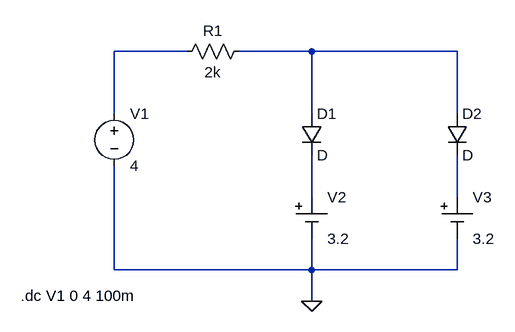
[diagram p0: schematic problem_354.asc]
problem_354.asc, the LTspice schematic file:
Version 4
SHEET 1 880 680
WIRE 160 32 48 32
WIRE 352 32 240 32
WIRE 576 32 352 32
WIRE 48 128 48 32
WIRE 352 128 352 32
WIRE 576 128 576 32
WIRE 352 256 352 192
WIRE 576 256 576 192
WIRE 48 368 48 208
WIRE 352 368 352 320
WIRE 352 368 48 368
WIRE 576 368 576 320
WIRE 576 368 352 368
WIRE 352 416 352 368
FLAG 352 416 0
SYMBOL voltage 48 112 R0
WINDOW 123 0 0 Left 0
WINDOW 39 0 0 Left 0
SYMATTR InstName V1
SYMATTR Value 4
SYMBOL res 144 48 R270
WINDOW 0 32 56 VTop 2
WINDOW 3 0 56 VBottom 2
SYMATTR InstName R1
SYMATTR Value 2k
SYMBOL diode 336 128 R0
SYMATTR InstName D1
SYMBOL diode 560 128 R0
SYMATTR InstName D2
SYMBOL Misc\\cell 352 256 R0
WINDOW 123 0 0 Left 0
WINDOW 39 0 0 Left 0
SYMATTR InstName V2
SYMATTR Value 3.2
SYMBOL Misc\\cell 576 256 R0
WINDOW 123 0 0 Left 0
WINDOW 39 0 0 Left 0
SYMATTR InstName V3
SYMATTR Value 3.2
TEXT -96 408 Left 2 !.dc V1 0 4 100m

The netlist it stands for:
* problem_354.asc
V1 N001 0 4
R1 N001 N002 2k
D1 N002 N003 D
D2 N002 N004 D
V2 N003 0 3.2
V3 N004 0 3.2
.model D D
.lib standard.dio
.dc V1 0 4 100m
.backanno
.end